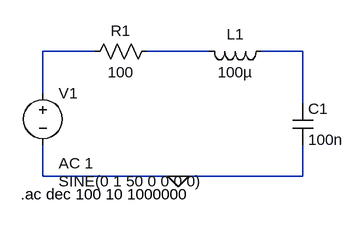
[diagram p0: schematic LC_filter.asc]
LC_filter.asc, the LTspice schematic file:
Version 4
SHEET 1 880 680
WIRE -16 96 -96 96
WIRE 160 96 64 96
WIRE 304 96 240 96
WIRE -96 160 -96 96
WIRE 304 176 304 96
WIRE -96 288 -96 240
WIRE 112 288 -96 288
WIRE 304 288 304 240
WIRE 304 288 112 288
FLAG 112 288 0
SYMBOL ind 256 80 R90
WINDOW 0 5 56 VBottom 2
WINDOW 3 32 56 VTop 2
SYMATTR InstName L1
SYMATTR Value 100µ
SYMBOL cap 288 176 R0
SYMATTR InstName C1
SYMATTR Value 100n
SYMBOL res 80 80 R90
WINDOW 0 0 56 VBottom 2
WINDOW 3 32 56 VTop 2
SYMATTR InstName R1
SYMATTR Value 100
SYMBOL voltage -96 144 R0
WINDOW 3 24 152 Left 2
WINDOW 123 24 124 Left 2
WINDOW 39 0 0 Left 0
SYMATTR InstName V1
SYMATTR Value SINE(0 1 50 0 0 0 0)
SYMATTR Value2 AC 1
TEXT -130 316 Left 2 !.ac dec 100 10 1000000

The netlist it stands for:
* LC_filter.asc
L1 N003 N002 100µ
C1 N003 0 100n
R1 N002 N001 100
V1 N001 0 SINE(0 1 50 0 0 0 0) AC 1
.ac dec 100 10 1000000
.backanno
.end